# Altium schematic sheet HDMI_CONVERTER.SchDoc: HDMI CONVERTER
size A3; Author: Silvio Navaretti; CompanyName: ARDUINO; DrawnBy: Silvio Navaretti; Engineer: Silvio Navaretti; Organization: ARDUINO; SheetNumber: 44; SheetTotal: 50; RevAuthor: Silvio Navaretti
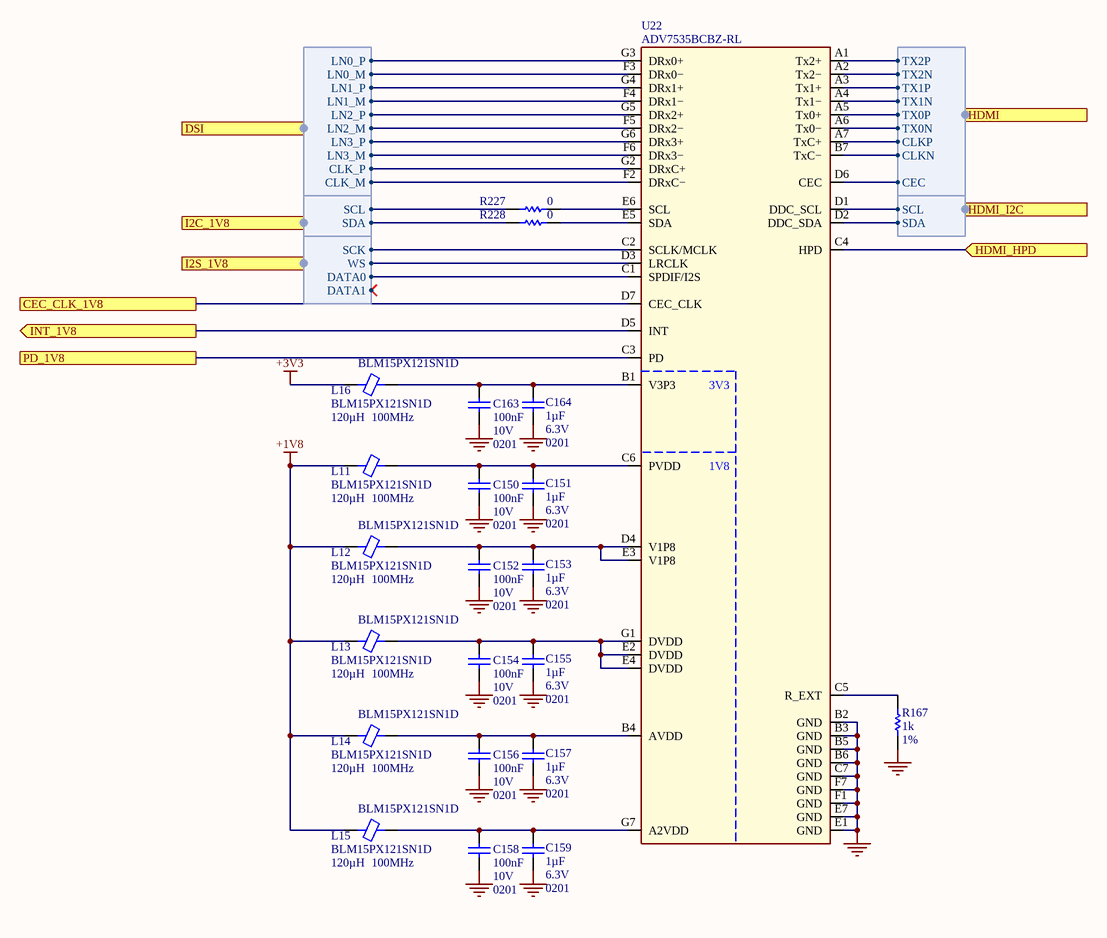
[diagram p0: HDMI_CONVERTER.SchDoc]

## Parts
C150  value 100nF  Voltage: 10V  Case Code (Imperial): 0201  [CAP-0201]  (hidden comment: CL03A104KP3NNNC)
C151  value 1µF  Voltage: 6.3V  Case Code (Imperial): 0201  [CAP-0201]  (hidden comment: GRM033R60J105MEA2D)
C152  value 100nF  Voltage: 10V  Case Code (Imperial): 0201  [CAP-0201]  (hidden comment: CL03A104KP3NNNC)
C153  value 1µF  Voltage: 6.3V  Case Code (Imperial): 0201  [CAP-0201]  (hidden comment: GRM033R60J105MEA2D)
C154  value 100nF  Voltage: 10V  Case Code (Imperial): 0201  [CAP-0201]  (hidden comment: CL03A104KP3NNNC)
C155  value 1µF  Voltage: 6.3V  Case Code (Imperial): 0201  [CAP-0201]  (hidden comment: GRM033R60J105MEA2D)
C156  value 100nF  Voltage: 10V  Case Code (Imperial): 0201  [CAP-0201]  (hidden comment: CL03A104KP3NNNC)
C157  value 1µF  Voltage: 6.3V  Case Code (Imperial): 0201  [CAP-0201]  (hidden comment: GRM033R60J105MEA2D)
C158  value 100nF  Voltage: 10V  Case Code (Imperial): 0201  [CAP-0201]  (hidden comment: CL03A104KP3NNNC)
C159  value 1µF  Voltage: 6.3V  Case Code (Imperial): 0201  [CAP-0201]  (hidden comment: GRM033R60J105MEA2D)
C163  value 100nF  Voltage: 10V  Case Code (Imperial): 0201  [CAP-0201]  (hidden comment: CL03A104KP3NNNC)
C164  value 1µF  Voltage: 6.3V  Case Code (Imperial): 0201  [CAP-0201]  (hidden comment: GRM033R60J105MEA2D)
L11  BLM15PX121SN1D  Inductance: 120µH  Test Frequency: 100MHz  [L-0402]
L12  BLM15PX121SN1D  Inductance: 120µH  Test Frequency: 100MHz  [L-0402]
L13  BLM15PX121SN1D  Inductance: 120µH  Test Frequency: 100MHz  [L-0402]
L14  BLM15PX121SN1D  Inductance: 120µH  Test Frequency: 100MHz  [L-0402]
L15  BLM15PX121SN1D  Inductance: 120µH  Test Frequency: 100MHz  [L-0402]
L16  BLM15PX121SN1D  Inductance: 120µH  Test Frequency: 100MHz  [L-0402]
R167  value 1k  Tolerance: 1%  [RES-0201]  (hidden comment: RC0201FR-071KL)
R227  value 0  [RES-0201]  (hidden comment: CRCW02010000Z0ED)
R228  value 0  [RES-0201]  (hidden comment: CRCW02010000Z0ED)
U22  ADV7535BCBZ-RL  [Analog Devices CB-49-1 WLCSP49 7x7 pitch 0.5mm 3.5x3.5mm]

## Ports
CEC_CLK_1V8, DSI (harness MIPI_4LANES), HDMI (harness HDMI), HDMI_HPD (in), HDMI_I2C (harness I2C), I2C_1V8 (harness I2C), I2S_1V8 (harness SOM_MD_I2S), INT_1V8 (out), PD_1V8

## Harnesses
I2C: SDA, SCL
MIPI_4LANES: LN3_M, LN2_M, LN2_P, LN0_M, LN0_P, CLK_M, CLK_P, LN1_M, LN1_P, LN3_P
HDMI: TX2P, TX2N, TX1P, TX1N, TX0P, TX0N, CLKP, CLKN, CEC
SOM_MD_I2S: SCK, WS, DATA0, DATA1

## Nets
+1V8: L11.1 L12.1 L13.1 L14.1 L15.1
+3V3: L16.1
GND: C150.1 C151.1 C152.1 C153.1 C154.1 C155.1 C156.1 C157.1 C158.1 C159.1 C163.1 C164.1 R167.1 U22.B2(GND) U22.B3(GND) U22.B5(GND) U22.B6(GND) U22.C7(GND) U22.E1(GND) U22.E7(GND) U22.F1(GND) U22.F7(GND)
CEC_CLK_1V8: U22.D7(CEC_CLK) ; port CEC_CLK_1V8
HDMI_HPD: U22.C4(HPD) ; port HDMI_HPD
INT_1V8: U22.D5(INT) ; port INT_1V8
PD_1V8: U22.C3(PD) ; port PD_1V8
NetC150_2: C150.2 C151.2 L11.2 U22.C6(PVDD)
NetC152_2: C152.2 C153.2 L12.2 U22.D4(V1P8) U22.E3(V1P8)
NetC154_2: C154.2 C155.2 L13.2 U22.E2(DVDD) U22.E4(DVDD) U22.G1(DVDD)
NetC156_2: C156.2 C157.2 L14.2 U22.B4(AVDD)
NetC158_2: C158.2 C159.2 L15.2 U22.G7(A2VDD)
NetC163_2: C163.2 C164.2 L16.2 U22.B1(V3P3)
NetR167_2: R167.2 U22.C5(R_EXT)
NetR227_1: R227.1 U22.E6(SCL)
NetR227_2: R227.2 ; port I2C_1V8.SCL
NetR228_1: R228.1 U22.E5(SDA)
NetR228_2: R228.2 ; port I2C_1V8.SDA
NetU22_A1: U22.A1(Tx2+) ; port HDMI.TX2P
NetU22_A2: U22.A2(Tx2−) ; port HDMI.TX2N
NetU22_A3: U22.A3(Tx1+) ; port HDMI.TX1P
NetU22_A4: U22.A4(Tx1−) ; port HDMI.TX1N
NetU22_A5: U22.A5(Tx0+) ; port HDMI.TX0P
NetU22_A6: U22.A6(Tx0−) ; port HDMI.TX0N
NetU22_A7: U22.A7(TxC+) ; port HDMI.CLKP
NetU22_B7: U22.B7(TxC−) ; port HDMI.CLKN
NetU22_C1: U22.C1(SPDIF/I2S) ; port I2S_1V8.DATA0
NetU22_C2: U22.C2(SCLK/MCLK) ; port I2S_1V8.SCK
NetU22_D1: U22.D1(DDC_SCL) ; port HDMI_I2C.SCL
NetU22_D2: U22.D2(DDC_SDA) ; port HDMI_I2C.SDA
NetU22_D3: U22.D3(LRCLK) ; port I2S_1V8.WS
NetU22_D6: U22.D6(CEC) ; port HDMI.CEC
NetU22_F2: U22.F2(DRxC−) ; port DSI.CLK_M
NetU22_F3: U22.F3(DRx0−) ; port DSI.LN0_M
NetU22_F4: U22.F4(DRx1−) ; port DSI.LN1_M
NetU22_F5: U22.F5(DRx2−) ; port DSI.LN2_M
NetU22_F6: U22.F6(DRx3−) ; port DSI.LN3_M
NetU22_G2: U22.G2(DRxC+) ; port DSI.CLK_P
NetU22_G3: U22.G3(DRx0+) ; port DSI.LN0_P
NetU22_G4: U22.G4(DRx1+) ; port DSI.LN1_P
NetU22_G5: U22.G5(DRx2+) ; port DSI.LN2_P
NetU22_G6: U22.G6(DRx3+) ; port DSI.LN3_P

## Notes on the sheet
- Title:
- ID:
- Date:
- Time:
- Version:
- Sheet
- of
- RevAuthor:
- Reference Designs ARE PROVIDED "AS IS" AND "WITH ALL FAULTS. Arduino SA DISCLAIMS ALL OTHER WARRANTIES, EXPRESS OR IMPLIED, REGARDING PRODUCTS, INCLUDING BUT NOT LIMITED TO, ANY IMPLIED WARRANTIES OF MERCHANTABILITY OR FITNESS FOR A PARTICULAR PURPOSE.
  Arduino SA may make changes to specifications and product descriptions at any time, without notice. The Customer must not rely on the absence or characteristics of any features or instructions marked "reserved" or "undefined".
  Arduino SA reserves these for future definition and shall have no responsibility whatsoever for conflicts or incompatibilities arising from future changes to them. The product information on the Web Site or Materials is subject to change without notice.
  Do not finalize a design with this info. ARDUINO and other Arduino brands and logos and Trademarks of Arduino SA. All Arduino SA Trademarks cannot be used without owner's formal permission.
- File:
- Author:
- (in symbol U0508-A.3) 3V3; 1V8

## Library data of the parts
C150 C152 C154 C156 C158 C163 = C0113-A.6: CAP CHIP 0201 100nF 10% 10V X5R; Manufacturer: Samsung Electro-Mechanics; Code Arduino: C0113; Technology: Ceramic; Part Number: CL03A104KP3NNNC; Dielectric: X5R; Tolerance: 10%
C151 C153 C155 C157 C159 C164 = C0002-A.15: CAP CHIP 0201 1uF 20% 6.3V X5R; Manufacturer: Murata; Code Arduino: A5520; Tolerance: 20%; Dielectric: X5R; Part Number: GRM033R60J105MEA2D; Technology: Ceramic
L11-L16 = I0028-A.10: FERRITE SMD 0402 120Ohm 25% 100MHz Ferrite 2A; Manufacturer: Murata; DC Resistance (DCR): 55mR; Code Arduino: I0028; Value: 120µH; Device Type: Ferrite; Packaging: Tape and Reel; Case Code (Imperial): 0402; Max DC Current: 2A; Case Code (Metric): 1005; Package Quantity: 10000; Current: 2A; Max Operating Temperature: 125°C; Tolerance: 25%; Min Operating Temperature: -55°C; Part Number: BLM15PX121SN1D
R167 = R0195-A.22: RES CHIP 0201 1k 1% 1/20W; Manufacturer: Yageo; Power: 50mW; Temperature coefficient: 200ppm; Code Arduino: R0195; Part Number: RC0201FR-071KL; Case Code (Imperial): 0201; Technology: Thick film
R227 R228 = R0140-A.21: RES CHIP 0201 0R; Manufacturer: Vishay; Temperature coefficient: 0ppm; Code Arduino: R0140; Power: 50mW; Tolerance: 0%; Technology: Thick film; Case Code (Imperial): 0201; Part Number: CRCW02010000Z0ED
U22 = U0508-A.3: IC DSI to HDMI converter, WLCSP49 3.5x3.5mm; Manufacturer: Analog Devices; Code Arduino: U0508; Part Number: ADV7535BCBZ-RL